# EAGLE design Elektroskate Teensy 08.08.2014 (EAGLE 6.6.0)
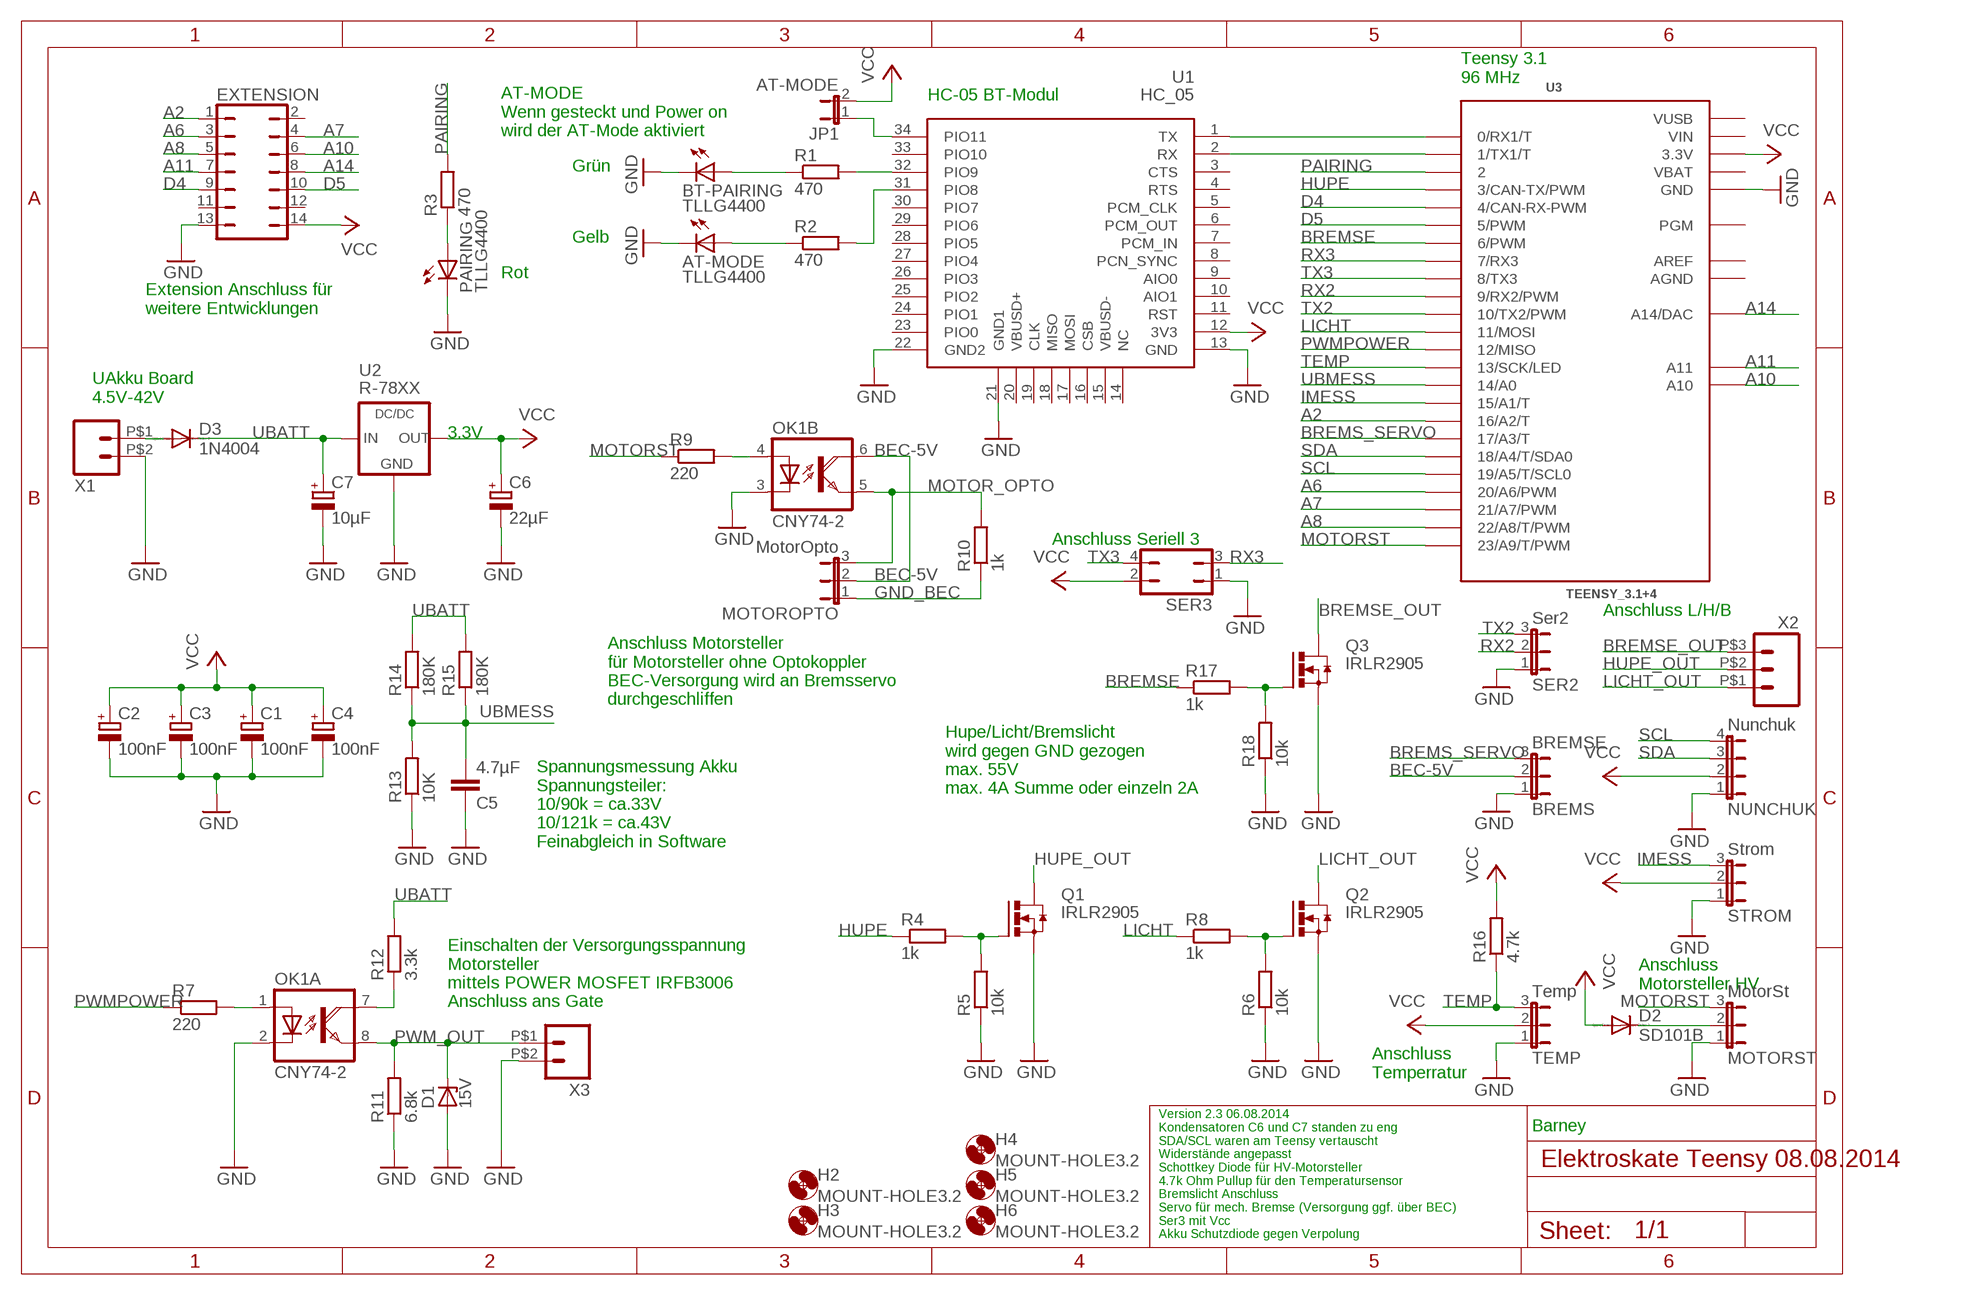
[diagram p0: schematic, sheet 1]

## Parts
AT-MODE  TLLG4400  [LED3MM]
BREMS  BREMSE  JP2E  [JP2]
BT-PAIRING  TLLG4400  [LED3MM]
C1  100nF  CPOL-EUB45181A  [B45181A]
C2  100nF  CPOL-EUB45181A  [B45181A]
C3  100nF  CPOL-EUB45181A  [B45181A]
C4  100nF  CPOL-EUB45181A  [B45181A]
C5  4.7µF  C-EU025-024X044  [C025-024X044]
C6  22µF  CPOL-EUE2.5-5  [E2,5-5]
C7  10µF  CPOL-EUE2-4  [E2-4]
D1  15V  ZPD  [DO35Z10]
D2  SD101B  MBR0520LT  [SOD123]
D3  1N4004  [DO41-10]
EXTENSION  JP7Q  [JP7Q]
H2  MOUNT-HOLE3.2  [3,2]
H3  MOUNT-HOLE3.2  [3,2]
H4  MOUNT-HOLE3.2  [3,2]
H5  MOUNT-HOLE3.2  [3,2]
H6  MOUNT-HOLE3.2  [3,2]
JP1  AT-MODE  JP1E  [JP1]
MOTOROPTO  MotorOpto  JP2E  [JP2]
MOTORST  MotorSt  JP2E  [JP2]
NUNCHUK  Nunchuk  JP4E  [JP4]
OK1  CNY74-2  ILD30  [DIL08]
PAIRING  TLLG4400  [LED3MM]
Q1  IRLR2905  [D-PAK_TO252AA]
Q2  IRLR2905  [D-PAK_TO252AA]
Q3  IRLR2905  [D-PAK_TO252AA]
R1  470  R-EU_0207/10  [0207/10]
R2  470  R-EU_0207/10  [0207/10]
R3  470  R-EU_0207/10  [0207/10]
R4  1k  R-EU_0207/10  [0207/10]
R5  10k  R-EU_0207/10  [0207/10]
R6  10k  R-EU_0207/10  [0207/10]
R7  220  R-EU_0207/10  [0207/10]
R8  1k  R-EU_0207/10  [0207/10]
R9  220  R-EU_0207/10  [0207/10]
R10  1k  R-EU_0207/10  [0207/10]
R11  6.8k  R-EU_0207/10  [0207/10]
R12  3.3k  R-EU_0207/10  [0207/10]
R13  10K  R-EU_0207/10  [0207/10]
R14  180K  R-EU_0207/10  [0207/10]
R15  180K  R-EU_0207/10  [0207/10]
R16  4.7k  R-EU_R0805  [R0805]
R17  1k  R-EU_0207/10  [0207/10]
R18  10k  R-EU_0207/10  [0207/10]
SER2  Ser2  JP2E  [JP2]
SER3  JP2Q  [JP2Q]
STROM  Strom  JP2E  [JP2]
TEMP  Temp  JP2E  [JP2]
U1  HC_05  [BLUETOOTH_SMD]
U2  R-78XX  [R-78XX]
U3  TEENSY_3.1+4  [TEENSY_3.1+4]
X1  PSS254_2GEWINKELT  [02W]
X2  PSS254_3GEWINKELT  [03W]
X3  PSS254_2GEWINKELT  [02W]

## Nets
A2: EXTENSION.1 U3.16/A2(16/A2/T)
A6: EXTENSION.3 U3.20/A6(20/A6/PWM)
A7: EXTENSION.4 U3.21/A7(21/A7/PWM)
A8: EXTENSION.5 U3.22/A8(22/A8/T/PWM)
A10: EXTENSION.6 U3.A10
A11: EXTENSION.7 U3.A11
A14: EXTENSION.8 U3.A14(A14/DAC)
BEC-5V: BREMS.2 MOTOROPTO.2 OK1.6(B:COL)
BREMS_SERVO: BREMS.3 U3.17/A3(17/A3/T)
BREMSE: R17.1 U3.6(6/PWM)
BREMSE_OUT: Q3.4(D) X2.P$3
D4: EXTENSION.9 U3.4(4/CAN-RX-PWM)
D5: EXTENSION.10 U3.5(5/PWM)
GND [24mil]: AT-MODE.K(C) BREMS.1 BT-PAIRING.K(C) C1.- C2.- C3.- C4.- C5.1 C6.- C7.- D1.A EXTENSION.13 MOTORST.1 NUNCHUK.1 OK1.2(A:C) OK1.3(B:C) PAIRING.K(C) Q1.3(S) Q2.3(S) Q3.3(S) R5.1 R6.1 R11.1 R13.1 R18.1 SER2.1 SER3.1 STROM.1 TEMP.1 U1.13(GND) U1.21(GND1) U1.22(GND2) U2.2(GND) U3.GND U3.GND1(GND) X1.P$2 X3.P$2
GND_BEC [24mil]: MOTOROPTO.1 R10.1
HUPE: R4.1 U3.3(3/CAN-TX/PWM)
HUPE_OUT: Q1.4(D) X2.P$2
IMESS: STROM.3 U3.15/A1(15/A1/T)
LICHT: R8.1 U3.11(11/MOSI)
LICHT_OUT: Q2.4(D) X2.P$1
MOTOR_OPTO: MOTOROPTO.3 OK1.5(B:EMI) R10.2
MOTORST: MOTORST.3 R9.1 U3.23/A9(23/A9/T/PWM)
N$1: U1.1(TX) U3.0(0/RX1/T)
N$2: U1.2(RX) U3.1(1/TX1/T)
N$3: BT-PAIRING.A R1.1
N$4: PAIRING.A R3.1
N$5: OK1.4(B:A) R9.2
N$6: R2.2 U1.31(PIO8)
N$7: AT-MODE.A R2.1
N$8: R1.2 U1.32(PIO9)
N$9: OK1.7(A:COL) R12.1
N$10: OK1.1(A:A) R7.2
N$11: D2.C MOTORST.2
N$12: Q3.1(G) R17.2 R18.2
N$13: D3.A X1.P$1
N$14: Q1.1(G) R4.2 R5.2
N$15: Q2.1(G) R6.2 R8.2
N$16: JP1.1 U1.34(PIO11)
PAIRING: R3.2 U3.2
PWM_OUT: D1.C OK1.8(A:EMI) R11.2 X3.P$1
PWMPOWER: R7.1 U3.12(12/MISO)
RX2: SER2.2 U3.9(9/RX2/PWM)
RX3: SER3.3 U3.7(7/RX3)
SCL: NUNCHUK.4 U3.19/A5(19/A5/T/SCL0)
SDA: NUNCHUK.3 U3.18/A4(18/A4/T/SDA0)
TEMP: R16.1 TEMP.3 U3.13(13/SCK/LED)
TX2: SER2.3 U3.10(10/TX2/PWM)
TX3: SER3.4 U3.8(8/TX3)
UBATT [24mil]: C7.+ D3.C R12.2 R14.2 R15.2 U2.1(IN)
UBMESS: C5.2 R13.2 R14.1 R15.1 U3.14/A0
VCC [48mil]: C1.+ C2.+ C3.+ C4.+ C6.+ D2.A EXTENSION.14 JP1.2 NUNCHUK.2 R16.2 SER3.2 STROM.2 TEMP.2 U1.12(3V3) U2.3(OUT) U3.3.3V U3.3.3V1(3.3V)
Unconnected: EXTENSION.2 EXTENSION.11 EXTENSION.12 U1.3(CTS) U1.4(RTS) U1.5(PCM_CLK) U1.6(PCM_OUT) U1.7(PCM_IN) U1.8(PCN_SYNC) U1.9(AIO0) U1.10(AIO1) U1.11(RST) U1.14(NC) U1.15(VBUSD-) U1.16(CSB) U1.17(MOSI) U1.18(MISO) U1.19(CLK) U1.20(VBUSD+) U1.23(PIO0) U1.24(PIO1) U1.25(PIO2) U1.26(PIO3) U1.27(PIO4) U1.28(PIO5) U1.29(PIO6) U1.30(PIO7) U1.33(PIO10) U3.PGM

## Notes on the sheet
- Teensy 3.1
  96 MHz
- HC-05 BT-Modul
- AT-MODE
  Wenn gesteckt und Power on
  wird der AT-Mode aktiviert
- Grün
- Gelb
- Rot
- Extension Anschluss für
  weitere Entwicklungen
- UAkku Board
  4.5V-42V
- Anschluss Seriell 3
- Anschluss L/H/B
- Anschluss Motorsteller
  für Motorsteller ohne Optokoppler
  BEC-Versorgung wird an Bremsservo
  durchgeschliffen
- Hupe/Licht/Bremslicht
  wird gegen GND gezogen
  max. 55V
  max. 4A Summe oder einzeln 2A
- Spannungsmessung Akku
  Spannungsteiler:
  10/90k = ca.33V
  10/121k = ca.43V
  Feinabgleich in Software
- Anschluss
  Motorsteller HV
- Einschalten der Versorgungsspannung
  Motorsteller
  mittels POWER MOSFET IRFB3006
  Anschluss ans Gate
- Anschluss
  Temperratur
- Barney
- Version 2.3 06.08.2014
  Kondensatoren C6 und C7 standen zu eng
  SDA/SCL waren am Teensy vertauscht
  Widerstände angepasst
  Schottkey Diode für HV-Motorsteller
  4.7k Ohm Pullup für den Temperatursensor
  Bremslicht Anschluss
  Servo für mech. Bremse (Versorgung ggf. über BEC)
  Ser3 mit Vcc
  Akku Schutzdiode gegen Verpolung

## Power pins joined to a net without a drawn wire
AGND: U3.AGND
AREF: U3.AREF
VBAT: U3.VBAT
VIN: U3.VIN
VUSB: U3.VUSB

## Library data of the parts
AT-MODE BT-PAIRING PAIRING = led:TLLG4400: Low Current (2mA) LED 3 mm Tinted Diffused Package color GREEN Source: Data sheet <http://www.farnell.com/datasheets/391098.pdf>; MF: VISHAY SEMICONDUCTOR; OC_FARNELL: 1612435
BREMS MOTOROPTO MOTORST SER2 STROM TEMP = jumper:JP2E: JUMPER
C1-C4 C6 C7 = rcl:CPOL-EU: POLARIZED CAPACITOR, European symbol
C5 = rcl:C-EU: CAPACITOR, European symbol
D1 = diode:ZPD: Z DIODE 500 mW
D2 = diode:MBR0520LT: SCHOTTKY BARRIER RECTIFIER Source: http://onsemi.com .. MBR0520LT1-D.pdf
D3 = diode:1N4004: DIODE general purpose rectifier, 1 A
EXTENSION = jumper:JP7Q: JUMPER
H2-H6 = holes:MOUNT-HOLE: MOUNTING HOLE with drill center marker
JP1 = jumper:JP1E: JUMPER
NUNCHUK = jumper:JP4E: JUMPER
OK1 = optocoupler:ILD30: SIEMENS OPTO COUPLER; MF: VISHAY/TELEFUNKEN; MPN: ILD30; OC_FARNELL: 1612448; OC_NEWARK: 58K1668
Q1-Q3 = International Rectifier:IRLR2905: SMPS MOSFET HEXFET® Power MOSFET Source: http://www.irf.com/product-info/datasheets/data/irf3704.pdf
R1-R18 = rcl:R-EU_: RESISTOR, European symbol
SER3 = jumper:JP2Q: JUMPER
U1 = Bluetooth HC-05:HC_05: HC-05 Bluetooth Module
U2 = recom-intl:R-78XX: DC-DC CONVERTER R-78xx-0.5 Series; SPANNUNG: 3.3V
U3 = Teensy_3_Series_Board_v1.0:TEENSY_3.1+4: Footprint for Teensy 3.1 board using all through-holes, i.e. the entire perimeter plus the 4 through-holes inboard (A10,A11,AREF, VUSB)
X1 X3 = con-pss254_reichelt:PSS254_2
X2 = con-pss254_reichelt:PSS254_3

## Net classes
0 default: width 0.305 mm, clearance 0.205 mm
1 24mil: width 0.61 mm, clearance 0.205 mm to class 0, clearance 0.205 mm
2 48mil: width 1.219 mm, clearance 0.205 mm to class 0, clearance 0.205 mm to class 1, clearance 0.205 mm
3 96mil: width 2.438 mm

## Board
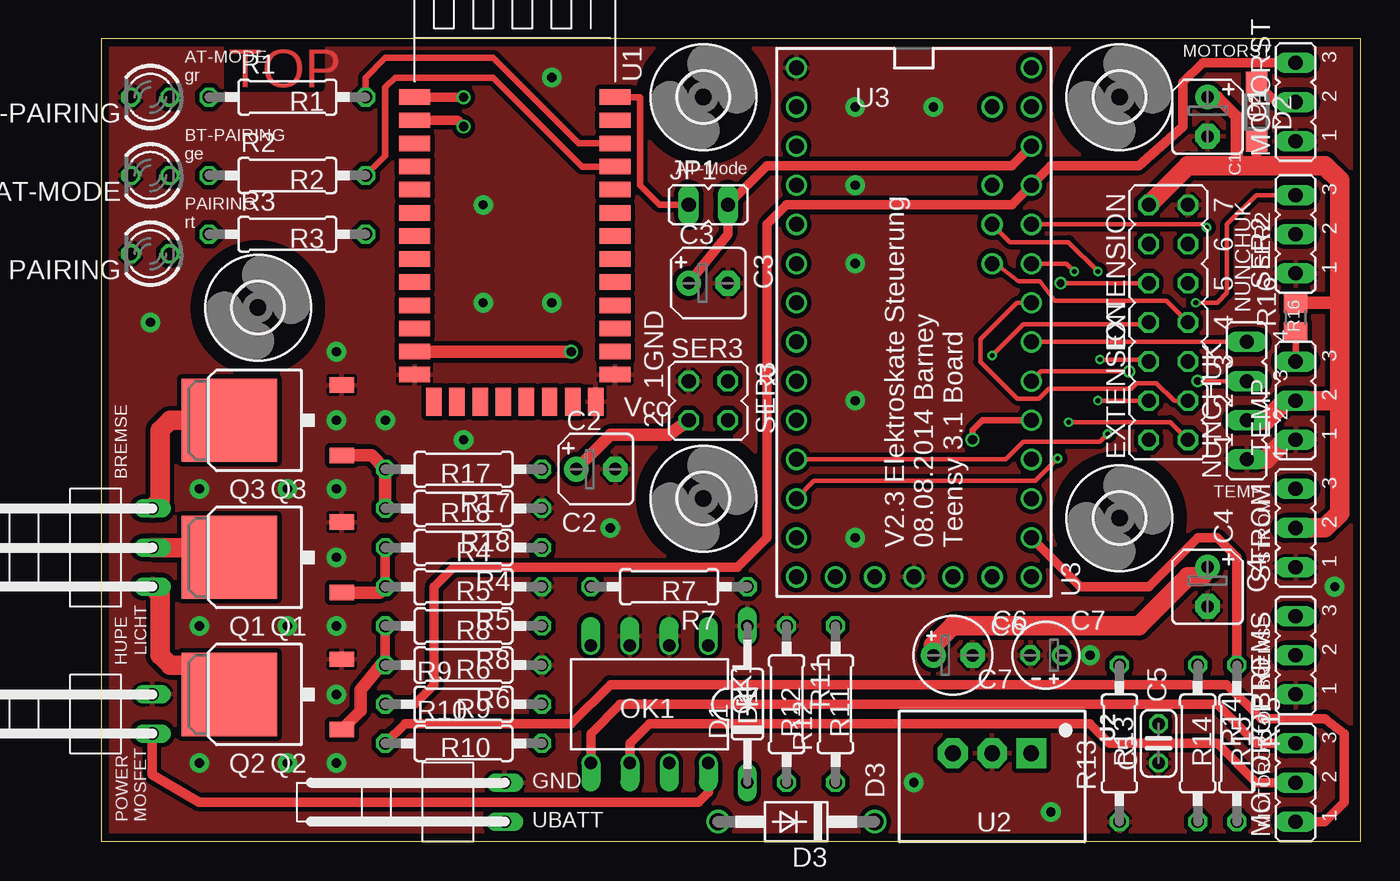
[diagram p1: board, top side]
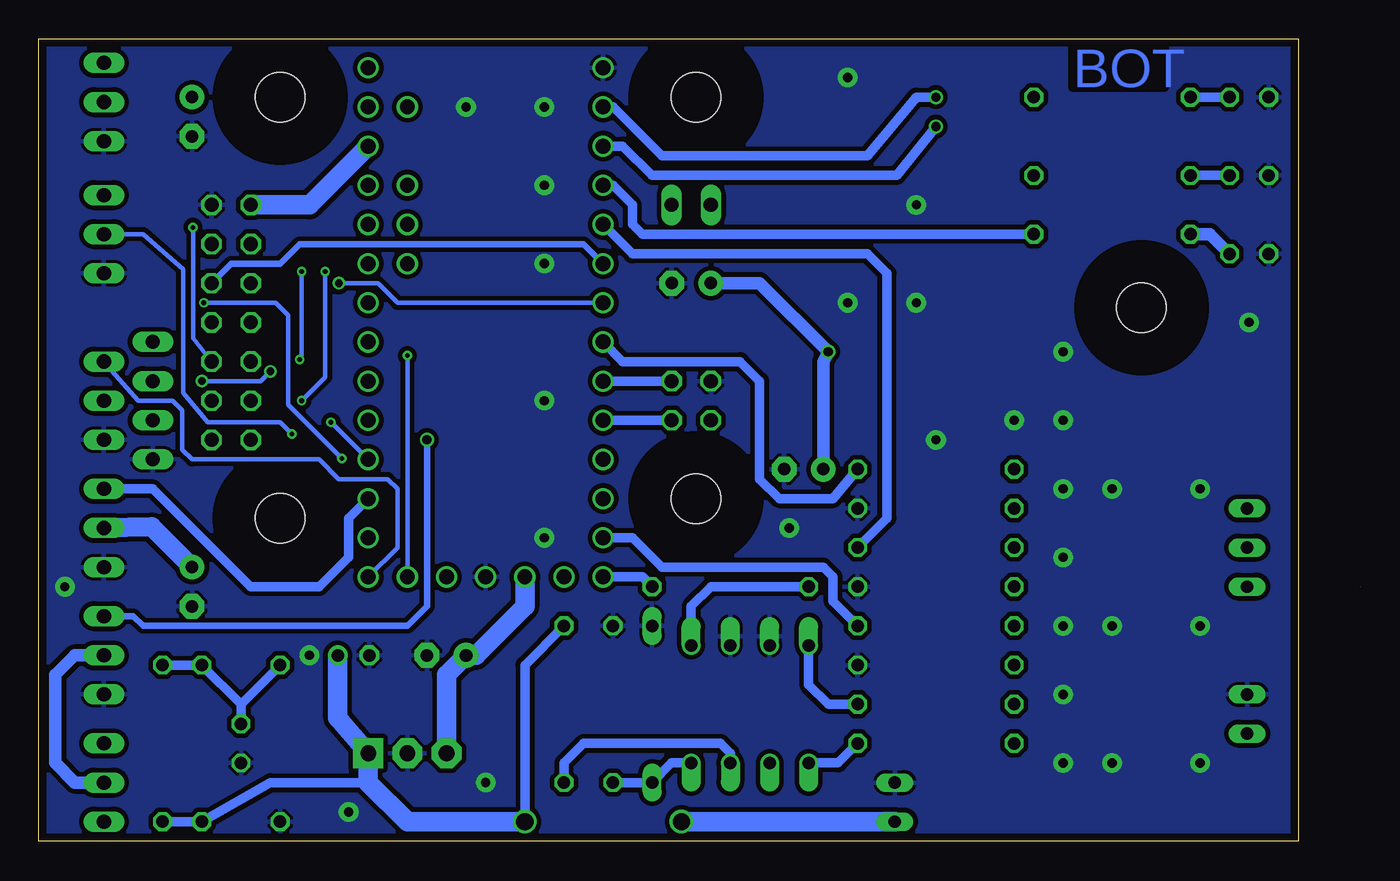
[diagram p2: board, bottom side, seen from below]

Size 81.71 x 52.06 mm. Coordinates in mm from the lower left corner, seen from the top.
Outline: 0,0 81.71,0 81.71,52.06 0,52.06 0,0
Copper layers (1*16): Top 0.035mm / dielectric 1.5mm / Bottom 0.035mm
Design rules "multi-cb_035um-cu *": minimum track width 6mil, minimum drill 12mil, track to track 6mil, track to pad 6mil, pad to pad 6mil, via to via 6mil, smd to smd 6mil, copper to edge 20mil, drill to drill 8mil, minimum pad ring 8mil, minimum via ring 6mil, stop-mask expansion 6mil, vias tented up to drill 0mil, thermal gap 8mil

### Footprints (pad centres in the part's own frame; a part is rotated, then mirrored left to right if it is on the bottom)
LED3MM = drill 0.813 octagon: A -1.27,0; K 1.27,0
JP2 = drill 0.914 long: 1 -2.54,0; 2 0,0; 3 2.54,0
B45181A = drill 0.813 pad 1.6: + -1.27,0 | drill 0.813 pad 1.6 octagon: - 1.27,0
C025-024X044 = drill 0.813 octagon: 1 -1.27,0; 2 1.27,0
E2,5-5 = drill 0.813 pad 1.6: + -1.27,0 | drill 0.813 pad 1.6 octagon: - 1.27,0
E2-4 = drill 0.813 pad 1.27: + -1.016,0 | drill 0.813 pad 1.27 octagon: - 1.016,0
DO35Z10 = drill 0.813 long: A 5.08,0; C -5.08,0
SOD123 = smd 1.4 x 1.4: A 1.9,0; C -1.9,0
DO41-10 = drill 1.118: A 5.08,0; C -5.08,0
JP7Q = drill 0.914 octagon: 1 -7.62,-1.27; 2 -7.62,1.27; 3 -5.08,-1.27; 4 -5.08,1.27; 5 -2.54,-1.27; 6 -2.54,1.27; 7 0,-1.27; 8 0,1.27; 9 2.54,-1.27; 10 2.54,1.27; 11 5.08,-1.27; 12 5.08,1.27; 13 7.62,-1.27; 14 7.62,1.27
3,2 = hole 3.2: 0,0
JP1 = drill 0.914 long: 1 0,-1.27; 2 0,1.27
JP4 = drill 0.914 long: 1 -3.81,0; 2 -1.27,0; 3 1.27,0; 4 3.81,0
DIL08 = drill 0.813 offset: 1 -3.81,-3.81; 2 -1.27,-3.81; 3 1.27,-3.81; 4 3.81,-3.81; 5 3.81,3.81; 6 1.27,3.81; 7 -1.27,3.81; 8 -3.81,3.81
D-PAK_TO252AA = smd 1 x 1.6: 1 -2.28,-4.8; 3 2.28,-4.8 | smd 5.4 x 6.2: 4 0,2.5
0207/10 = drill 0.813 octagon: 1 -5.08,0; 2 5.08,0
R0805 = smd 1.3 x 1.5: 1 -0.95,0; 2 0.95,0
JP2Q = drill 0.914 octagon: 1 -1.27,-1.27; 2 1.27,-1.27; 3 -1.27,1.27; 4 1.27,1.27
BLUETOOTH_SMD = smd 2 x 1: 1 -6.35,3.81; 2 -6.35,2.31; 3 -6.35,0.81; 4 -6.35,-0.69; 5 -6.35,-2.19; 6 -6.35,-3.69; 7 -6.35,-5.19; 8 -6.35,-6.69; 9 -6.35,-8.19; 10 -6.35,-9.69; 11 -6.35,-11.19; 12 -6.35,-12.69; 13 -6.35,-14.19; 22 6.65,-14.19; 23 6.65,-12.69; 24 6.65,-11.19; 25 6.65,-9.69; 26 6.65,-8.19; 27 6.65,-6.69; 28 6.65,-5.19; 29 6.65,-3.69; 30 6.65,-2.19; 31 6.65,-0.69; 32 6.65,0.81; 33 6.65,2.31; 34 6.65,3.81 | smd 1 x 1.8: 14 -5.1,-15.94; 15 -3.6,-15.94; 16 -2.1,-15.94; 17 -0.6,-15.94; 18 0.9,-15.94; 19 2.4,-15.94; 20 3.9,-15.94; 21 5.4,-15.94
R-78XX = drill 1.016 pad 1.93 square: 1 -2.54,0 | drill 1.016 pad 1.93 octagon: 2 0,0; 3 2.54,0
TEENSY_3.1+4 = drill 0.965: 0 -7.62,15.24; 1 -7.62,12.7; 2 -7.62,10.16; 3 -7.62,7.62; 3.3V 7.62,12.7; 3.3V1 -2.54,-15.24; 4 -7.62,5.08; 5 -7.62,2.54; 6 -7.62,0; 7 -7.62,-2.54; 8 -7.62,-5.08; 9 -7.62,-7.62; 10 -7.62,-10.16; 11 -7.62,-12.7; 12 -7.62,-15.24; 13 7.62,-15.24; 14/A0 7.62,-12.7; 15/A1 7.62,-10.16; 16/A2 7.62,-7.62; 17/A3 7.62,-5.08; 18/A4 7.62,-2.54; 19/A5 7.62,0; 20/A6 7.62,2.54; 21/A7 7.62,5.08; 22/A8 7.62,7.62; 23/A9 7.62,10.16; A10 5.08,7.62; A11 5.08,5.08; A14 5.08,-15.24; AGND 7.62,15.24; AREF 5.08,10.16; GND -7.62,17.78; GND1 0,-15.24; PGM 2.54,-15.24; VBAT -5.08,-15.24; VIN 7.62,17.78; VUSB 5.08,15.24
02W = drill 0.8 long: P$1 1.27,-2.032; P$2 3.81,-2.032
03W = drill 0.8 long: P$1 1.27,-2.032; P$2 3.81,-2.032; P$3 6.35,-2.032

### Placement (x,y rotation side)
AT-MODE  3.17,43.18 180 top
BREMS  77.47,12.06 90 top
BT-PAIRING  3.17,48.26 180 top
C1  71.75,46.99 270 top
C2  32.07,24.13 0 top
C3  39.37,36.2 0 top
C4  71.75,16.51 270 top
C5  68.58,6.35 90 top
C6  55.24,12.06 0 top
C7  61.28,12.06 180 top
D1  41.91,8.89 90 top
D2  74.93,47.31 270 top
D3  45.09,1.27 180 top
EXTENSION  69.22,33.66 90 top
H2  39.05,48.26 0 top
H3  10.16,34.61 0 top
H4  66.04,20.95 0 top
H5  39.05,22.23 0 top
H6  66.04,48.26 0 top
JP1  39.37,41.27 270 top
MOTOROPTO  77.47,3.81 90 top
MOTORST  77.47,47.94 90 top
NUNCHUK  74.3,28.57 90 top
OK1  35.56,8.89 180 top
PAIRING  3.17,38.1 180 top
Q1  10.79,18.41 90 top
Q2  10.79,9.53 90 top
Q3  10.79,27.3 90 top
R1  12.06,48.26 0 top
R2  12.06,43.18 0 top
R3  12.06,39.37 0 top
R4  23.5,19.05 180 top
R5  23.5,16.51 180 top
R6  23.5,11.43 180 top
R7  36.83,16.51 180 top
R8  23.5,13.97 180 top
R9  23.5,8.89 0 top
R10  23.5,6.35 0 top
R11  44.45,8.89 270 top
R12  47.62,8.89 90 top
R13  66.04,6.35 90 top
R14  71.12,6.35 270 top
R15  73.66,6.35 270 top
R16  77.47,33.97 90 top
R17  23.5,24.13 180 top
R18  23.5,21.59 180 top
SER2  77.47,39.37 90 top
SER3  39.37,28.57 270 top
STROM  77.47,20.32 90 top
TEMP  77.47,28.57 90 top
U1  26.67,44.45 0 top
U2  57.78,5.71 180 top
U3  52.7,32.38 0 top
X1  24.13,0 90 top
X2  1.27,15.24 90 top
X3  1.27,5.71 90 top

### Tracks (layer width: path | path; a pad name or v marks a point on that pad's centre or on a via)
A2  (via drill 0.3)
  Top 0.305: EXTENSION.1 69.34,27.18 v62.74,27.18
  Bottom 0.305: U3.16/A2 v62.74,27.18
A6
  Top 0.305: U3.20/A6 59.39,34.92 57.02,32.56 57.02,31.11 59.44,28.7 60.83,28.7 61.47,29.34 66.8,29.34 67.18,29.72 68.45,29.72 69.6,28.57 EXTENSION.3
A7  (via drill 0.3)
  Top 0.305: v64.64,28.57 EXTENSION.4 | v63.12,36.96 62.61,37.47 U3.21/A7
  Bottom 0.305: v64.64,28.57 63.12,30.1 v63.12,36.96
A8  (via drill 0.3)
  Top 0.305: v71.69,39.81 71.5,40.01 U3.22/A8
  Bottom 0.305: EXTENSION.5 71.69,32.64 v71.69,39.81
A10  (via drill 0.3)
  Top 0.305: EXTENSION.6 67.82,31.24 v64.77,31.24 | v64.64,36.96 62.74,38.86 58.93,38.86 U3.A10
  Bottom 0.305: v64.77,31.24 64.64,31.37 v64.64,36.96
A11
  Top 0.305: EXTENSION.7 69.09,35.05 61.85,35.05 60.9,36.32 59.5,36.32 58.04,37.47 U3.A11
A14  (via drill 0.3)
  Top 0.305: EXTENSION.8 67.82,33.53 59.82,33.53 v57.78,31.5
  Bottom 0.305: U3.A14 v57.78,31.5
BEC-5V
  Top 0.61: OK1.6 34.29,6.35 35.56,7.62 64.14,7.62 65.41,6.35 72.39,6.35 74.93,3.81 MOTOROPTO.2
  Bottom 0.813: BREMS.2 79.38,12.06 80.64,10.79 80.64,5.08 79.38,3.81 MOTOROPTO.2
BREMS_SERVO  (via drill 0.6)
  Top 0.406: U3.17/A3 57.15,27.3 56.52,26.67 v56.52,26.04
  Bottom 0.406: v56.52,26.04 56.52,15.24 57.78,13.97 74.93,13.97 75.56,14.61 BREMS.3
BREMSE
  Bottom 0.61: U3.6 43.81,31.11 36.2,31.11 34.92,29.84 34.92,23.5 33.66,22.23 30.16,22.23 R17.1
BREMSE_OUT
  Top 1.27: X2.P$3 3.81,22.1 3.81,26.67 4.45,27.3 Q3.4
D4
  Bottom 0.406: U3.4 46.35,38.73 64.77,38.73 66.04,37.47 69.22,37.47 EXTENSION.9
D5  (via drill 0.5)
  Top 0.305: EXTENSION.10 v62.23,36.2
  Bottom 0.305: U3.5 58.42,34.92 59.69,36.2 v62.23,36.2
GND  (via drill 0.6 pad 1.27)
  Top 1.27: NUNCHUK.1 75.56,24.77 76.83,26.04 TEMP.1
  other vias: 6.35,5.08 15.24,5.08 15.24,9.53 12.06,13.97 6.35,13.97 15.24,18.41 24.77,41.27 29.21,34.92 23.5,26.04 48.9,47.62 53.98,47.62 64.14,12.06 12.06,22.86 6.35,22.86 15.24,27.3 3.17,33.66 18.41,27.3 52.7,3.81 33.02,20.32 48.9,37.47 48.9,28.57 24.77,34.92 48.9,19.68 61.59,1.91 80.01,16.51 29.21,49.53 48.9,42.55 15.24,31.75 15.24,22.86 15.24,13.97 12.06,5.08
  pour Top (isolate 0.305): 0,0 0,52.07 81.28,52.07 81.92,52.07 81.92,0
  pour Bottom (isolate 0.305): 0,0 0,52.07 81.92,52.07 81.92,0
GND_BEC
  Top 0.61: MOTOROPTO.1 79.38,1.27 80.64,2.54 80.64,6.99 79.38,7.94 75.25,7.94 73.03,10.16 33.02,10.16 30.48,7.62 19.68,7.62 R10.1
HUPE
  Bottom 0.61: R4.1 26.67,20.95 26.67,36.83 27.94,38.1 43.18,38.1 U3.3
HUPE_OUT
  Top 1.27: X2.P$2 7.62,19.05 8.26,18.41 Q1.4
IMESS
  Bottom 0.61: U3.15/A1 61.59,20.95 61.59,18.41 63.5,16.51 67.94,16.51 74.3,22.86 STROM.3
LICHT
  Bottom 0.61: R8.1 30.16,15.56 30.16,17.14 30.8,17.78 41.27,17.78 43.18,19.68 U3.11
LICHT_OUT
  Top 1.27: X2.P$1 3.81,16 3.81,12.06 4.45,11.43 7.62,11.43 8.29,10.76 Q2.4
MOTOR_OPTO
  Top 0.61: OK1.5 31.75,6.99 33.66,8.89 72.39,8.89 74.93,6.35 MOTOROPTO.3
  Bottom 0.61: R10.2 29.84,5.08 OK1.5
MOTORST
  Top 0.61: R9.1 20.32,8.89 21.59,10.16 21.59,16.51 22.86,17.78 41.27,17.78 43.18,19.68 43.18,40.01 44.45,41.27 59.05,41.27 U3.23/A9 61.59,43.81 67.31,43.81 70.17,46.35 70.17,49.21 71.44,50.48 MOTORST.3
N$1  (via drill 0.6)
  Top 0.61: v23.5,48.26 U1.1
  Bottom 0.61: U3.0 44.45,47.62 41.27,44.45 27.94,44.45 24.77,48.26 v23.5,48.26
N$2  (via drill 0.6)
  Top 0.61: v23.5,46.35 23.09,46.76 U1.2
  Bottom 0.61: U3.1 43.81,45.09 41.91,43.18 26.04,43.18 v23.5,46.35
N$3
  Bottom 0.61: BT-PAIRING.A R1.1
N$4
  Bottom 0.813: PAIRING.A 5.71,39.37 R3.1
N$5
  Bottom 0.61: OK1.4 31.75,10.16 30.48,8.89 R9.2
N$6
  Top 0.406: R2.2 18.41,44.45 18.41,48.9 19.05,49.53 25.4,49.53 31.17,43.76 U1.31
N$7
  Bottom 0.61: AT-MODE.A R2.1
N$8
  Top 0.406: R1.2 17.14,49.53 18.41,50.8 25.4,50.8 30.94,45.26 U1.32
N$9
  Bottom 0.61: R12.1 47.62,5.08 46.35,6.35 37.47,6.35 36.83,5.71 OK1.7
N$10
  Bottom 0.61: R7.2 38.1,16.51 39.37,15.24 OK1.1
N$11
  Top 0.61: MOTORST.2 76.2,47.94 D2.C
N$12
  Top 0.813: R18.2 R17.2 17.52,25.02 Q3.1
N$13
  Bottom 1.27: X1.P$1 D3.A
N$14
  Top 0.61: R4.2 R5.2
  Top 0.813: R5.2 18.04,16.14 Q1.1
N$15
  Top 0.61: R8.2 R6.2
  Top 0.813: Q2.1 16.83,8.48 16.83,9.84 18.1,11.43 R6.2
N$16
  Top 0.406: U1.34 34.92,48.26 34.92,42.55 36.2,41.27 JP1.1
PAIRING
  Bottom 0.61: R3.2 42.55,39.37 43.18,40.01 43.18,41.27 44.45,42.55 U3.2
PWM_OUT
  Top 0.61: OK1.8 39.37,3.17 38.73,2.54 6.35,2.54 3.3,4.32 X3.P$1
  Bottom 0.61: R11.2 D1.C 40.64,5.08 OK1.8
PWMPOWER
  Bottom 0.61: R7.1 42.55,17.14 U3.12
RX2  (via drill 0.3)
  Top 0.305: v65.28,26.42 64.77,25.91 59.82,25.91 58.67,24.77 U3.9
  Bottom 0.305: SER2.2 74.93,39.37 72.33,37.08 72.33,29.08 70.74,27.18 66.04,27.18 v65.28,26.42
RX3
  Bottom 0.61: SER3.3 U3.7
SCL
  Top 0.305: U3.19/A5 NUNCHUK.4
SDA  (via drill 0.5)
  Top 0.305: U3.18/A4 60.96,30.48 v66.67,30.48 | v71.12,29.84 NUNCHUK.3
  Bottom 0.305: v66.67,30.48 67.31,29.84 v71.12,29.84
TEMP
  Top 0.406: R16.1 TEMP.3
  Bottom 0.305: U3.13 58.42,19.05 58.42,22.86 59.05,23.5 62.23,23.5 63.5,24.77 71.75,24.77 72.39,25.4 72.39,27.94 73.03,28.57 75.25,28.57 TEMP.3
TX2  (via drill 0.3)
  Top 0.305: SER2.3 74.93,41.91 73.03,40.01 73.03,35.56 72.39,34.92 v70.99,34.92 | v62.04,24.83 60.58,23.37 46.23,23.37 U3.10
  Bottom 0.305: v70.99,34.92 66.34,34.92 65.53,34.11 65.53,28.32 v62.04,24.83
TX3
  Bottom 0.61: U3.8 SER3.4
UBATT
  Bottom 0.61: R15.2 R14.2 66.67,3.81 60.33,3.81 | R12.2 50.16,11.43 D3.C
  Bottom 1.27: D3.C 57.78,1.27 60.33,3.81 U2.1 62.29,8 C7.+
UBMESS
  Top 0.61: U3.14/A0 63.5,16.51 67.94,16.51 71.12,19.68 72.39,19.68 73.66,18.41 R15.1
  Bottom 0.61: R15.1 R14.1 68.58,8.89 | R13.2 68.58,8.89 | 68.58,8.89 C5.2
VCC  (via drill 0.6)
  Top 0.406: 80.33,33.34 80.33,32.7
  Top 0.61: U3.3.3V 59.05,43.81 43.18,43.81 JP1.2 40.64,39.37 C3.+ | D2.A 74.93,43.81
  Top 0.813: U1.12 v30.48,31.75 | 73.66,43.81 73.66,46.99 72.39,48.26 C1.+ | SER3.2 36.83,26.35 33.02,26.35 C2.+ | R16.2 77.79,34.92 80.33,34.92
  Top 1.27: STROM.2 79.38,20.32 80.33,21.27 80.33,28.57 | 80.33,28.57 80.33,32.7 80.33,34.92 80.33,42.86 79.38,43.81 74.93,43.81 73.66,43.81 70.48,43.81 EXTENSION.14 | C4.+ 71.37,17.14 70.48,17.14 67.31,13.97 55.24,13.97 53.98,12.7 C6.+ | 80.33,28.57 TEMP.2 76.83,28.57 75.56,27.3 NUNCHUK.2
  Bottom 0.813: C3.+ 34.92,36.2 v30.48,31.75 30.8,31.11 C2.+
  Bottom 1.27: U2.3 55.24,10.79 C6.+ 53.34,12.06 50.16,15.24 U3.3.3V1 | STROM.2 74.36,20.38 C4.+ | U3.3.3V 64.14,41.27 EXTENSION.14

### Text on the board
Top: TOP
Bottom: BOT
_tNames: MOTORST | AT-MODE / gr | R1 | U1 | D2 | BT-PAIRING / ge | R2 | AT-Mode | C1 | PAIRING / rt | R3 | C3 | SER2 | NUNCHUK | SER3 | R16 | EXTENSION | GND | R | Vcc | T | R17 | BREMSE | TEMP | Q3 | R18 | C4 | C2 | R4 | V2.3 Elektroskate Steuerung / 08.08.2014 Barney / Teensy 3.1 Board | STROM | R5 | R7 | U3 | R8 | C6 | C7 | Q1 | LICHT | R6 | HUPE | D1 | R12 | R11 | BREMSE | R9 | OK1 | C5 | R13 | R14 | R15 | R10 | Q2 | GND | D3 | U2 | POWER / MOSFET | UBATT | MOTOROPTO